# EAGLE design 105_vibrator (EAGLE 9.6.2)
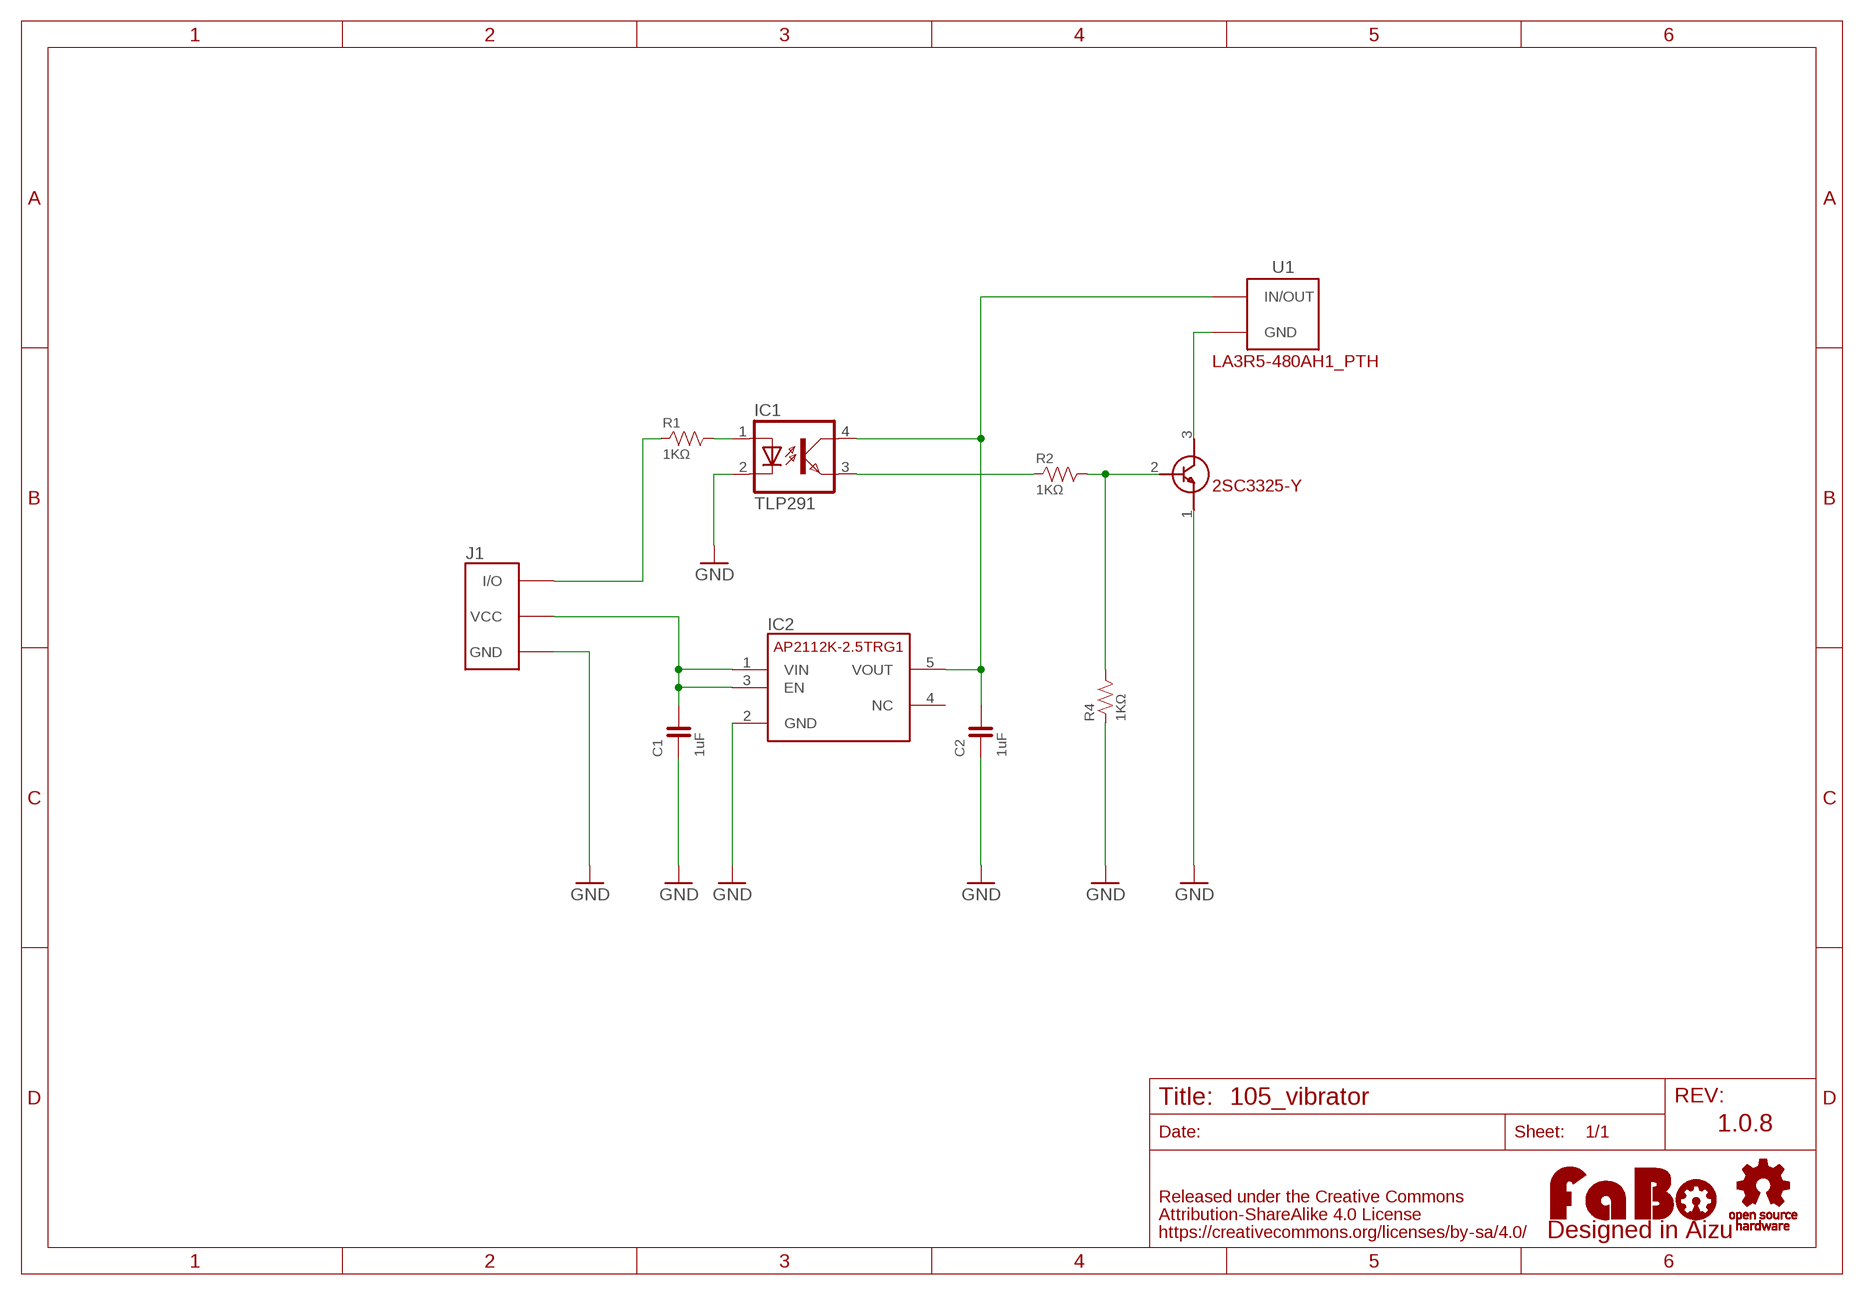
[diagram p0: schematic, sheet 1]

## Parts
C1  1uF  CAPACITOR-0603  [0603]
C2  1uF  CAPACITOR-0603  [0603]
IC1  TLP291  [MINI-FLAT-4]
IC2  AP2112-2.5  [SOT-23-5]
J1  FABO_BRICK_3PIN  [FABO_BRICK_3PIN]
LOGO1  LOGO_FABO-M  [LOGO_FABO_M]
R1  1KΩ  RESISTOR-0603  [0603]
R2  1KΩ  RESISTOR-0603  [0603]
R4  1KΩ  RESISTOR-0603  [0603]
TR1  2SC3325-Y  [SC-59]
U1  VIBRATOR  [LA3R5-480AH1_PTH]
U$2  LOGO_OSHW-M_BOTTOM  [LOGO_OSHW_M_BOTTOM]

## Nets
GND: C1.1 C2.1 IC1.2(C) IC2.2(GND) J1.GND R4.1 TR1.1(E)
N$1: J1.I/O R1.1
N$2: IC1.1(A) R1.2
N$4: IC1.3(EMIT) R2.1
N$5: C2.2 IC1.4(COL) IC2.5(VOUT) U1.P$1(IN/OUT)
N$7: TR1.3(C) U1.P$2(GND)
N$8: R2.2 R4.2 TR1.2(B)
VCC: C1.2 IC2.1(VIN) IC2.3(EN) J1.VCC
Unconnected: IC2.4(NC)

## Notes on the sheet
- LA3R5-480AH1_PTH
- 1.0.8

## Library data of the parts
C1 C2 = FaBo-Capacitor:CAPACITOR: CAPACITOR
IC1 = FaBo-Transistor:TLP291
IC2 = FaBo-Supply:AP2112-2.5
J1 = FaBo-Template:FABO_BRICK_3PIN: FaBo Brick 3pin
LOGO1 = component:LOGO_FABO
R1 R2 R4 = FaBo-Resistors:RESISTOR: RESISTOR
TR1 = FaBo-Transistor:2SC3325-Y
U1 = FaBo-Parts:VIBRATOR
U$2 = FaBo-etc:LOGO_OSHW

## Board
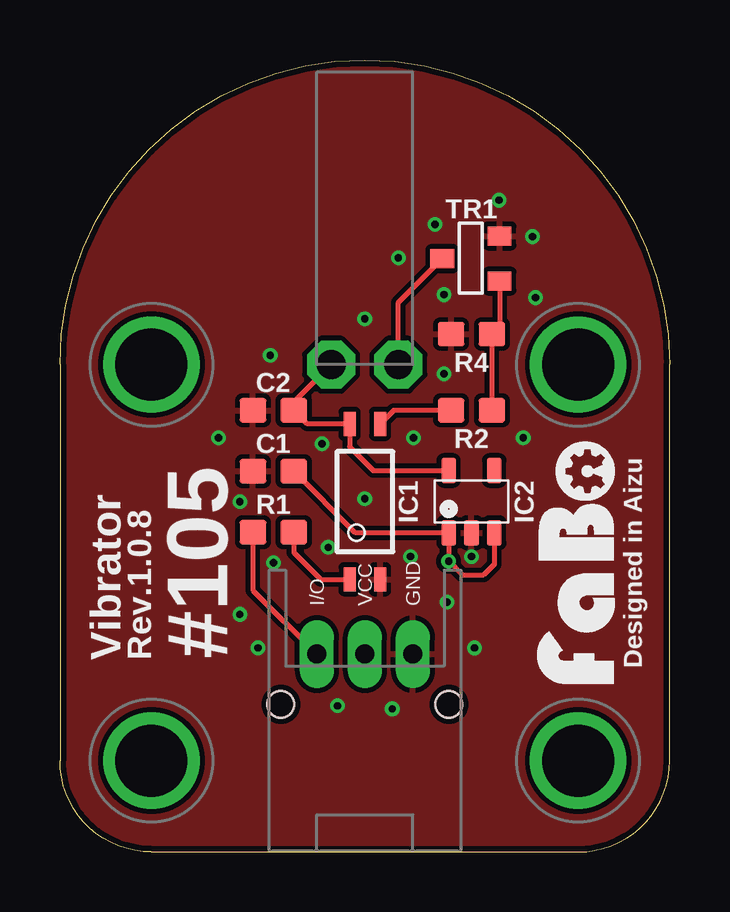
[diagram p1: board, top side]
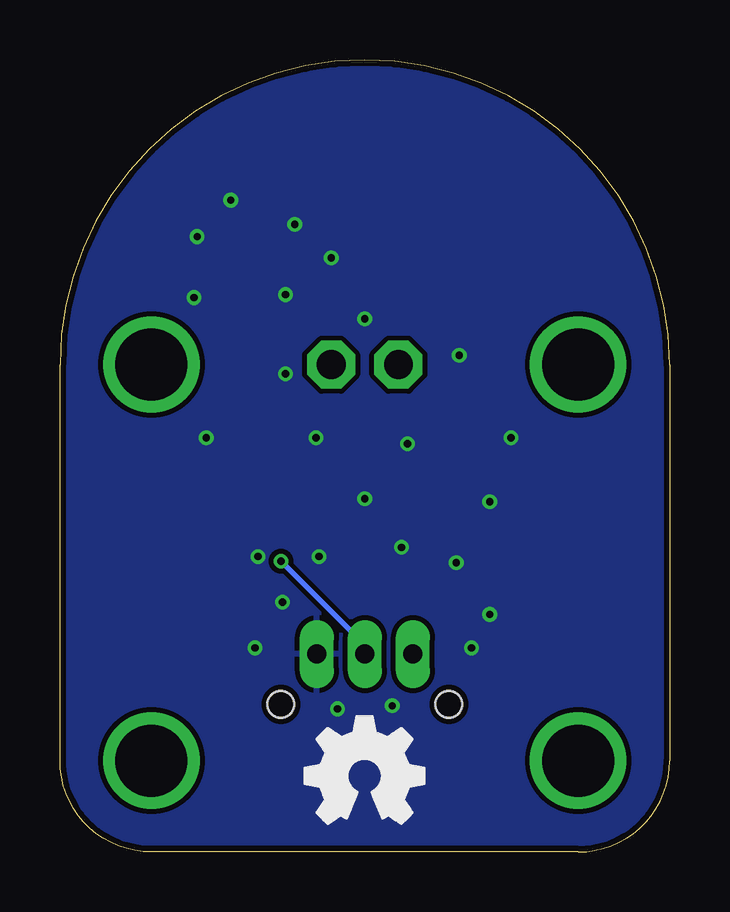
[diagram p2: board, bottom side, seen from below]

Size 25.4 x 33.02 mm. Coordinates in mm from the lower left corner, seen from the top.
Copper layers (1*16): Top 0.035mm / dielectric 1.6mm / Bottom 0.035mm
Design rules "PCBway": minimum track width 6mil, minimum drill 12mil, track to track 6mil, track to pad 6mil, pad to pad 6mil, via to via 6mil, smd to smd 6mil, copper to edge 10mil, drill to drill 10mil, minimum pad ring 10mil, minimum via ring 6mil, stop-mask expansion 2mil, vias tented up to drill 100mil, thermal gap 8mil

### Footprints (pad centres in the part's own frame; a part is rotated, then mirrored left to right if it is on the bottom)
0603 = smd 1.1 x 1: 1 -0.85,0; 2 0.85,0
MINI-FLAT-4 = smd 1 x 0.5: 1 -3.24,0.635; 2 -3.24,-0.635; 3 3.24,-0.635; 4 3.24,0.635
SOT-23-5 = smd 0.6 x 1.05: 1 -0.95,-1.3; 2 0,-1.3; 3 0.95,-1.3; 4 0.95,1.3; 5 -0.95,1.3
FABO_BRICK_3PIN = drill 0.8 pad 1.422 long: GND 2,-8.255; I/O -2,-8.255; VCC 0,-8.255 | drill 3 pad 3.81: P$1 -8.89,3.81; P$2 8.89,3.81; P$3 -8.89,-12.7; P$4 8.89,-12.7 | hole 1.1: -3.5,-10.355; 3.5,-10.355
SC-59 = smd 0.787 x 0.991: 1 -0.914,1.168; 2 0.965,1.168; 3 0.025,-1.219
LA3R5-480AH1_PTH = drill 1.2 pad 2 octagon: P$1 -1.4,0; P$2 1.4,0

### Placement (x,y rotation side)
C1  8.89,15.88 0 top
C2  8.89,18.41 0 top
IC1  12.7,14.61 90 top
IC2  17.14,14.61 0 top
J1  12.7,16.51 0 top
LOGO1  23.5,12.06 90 top
R1  8.89,13.34 0 top
R2  17.14,18.41 0 top
R4  17.14,21.59 0 top
TR1  17.14,24.77 270 top
U1  12.7,20.32 0 top
U$2  12.7,3.17 0 top

### Tracks (layer width: path | path; a pad name or v marks a point on that pad's centre or on a via)
GND  (via drill 0.3)
  other vias: 17.14,12.32 14.61,12.32 11.18,12.7 8.89,12.06 10.92,17.02 14.73,17.27 12.7,14.73 16.13,10.41 16,19.94 16,23.24 8.76,20.7 19.81,23.11 19.3,17.27 6.6,17.27 7.49,14.61 7.49,9.91 13.84,5.97 11.56,6.1 17.27,8.51 8.26,8.51 12.7,22.23 14.1,24.77 15.62,26.16 19.68,25.65 18.29,27.18
  pour Bottom (isolate 0.203): 0,0 25.4,0 25.4,33.02 0,33.02
  pour Top (isolate 0.203): 0,0 25.4,0 25.4,33.02 0,33.02
N$1
  Top 0.203: R1.1 8.04,10.91 J1.I/O
N$2
  Top 0.203: IC1.1 10.86,11.37 9.74,12.48 R1.2
N$4
  Top 0.203: R2.1 13.9,18.41 IC1.3
N$5
  Top 0.203: IC2.5 13.05,15.9 12.06,16.89 IC1.4 10.31,17.84 C2.2 9.74,18.76 U1.P$1
N$7
  Top 0.203: U1.P$2 14.1,22.91 TR1.3
N$8
  Top 0.203: R2.2 R4.2 18.31,21.91 TR1.2
VCC  (via drill 0.3)
  Top 0.203: IC2.3 18.09,12 17.65,11.56 16.76,11.56 v16.2,12.13 IC2.1 12.31,13.3 C1.2
  Bottom 0.203: J1.VCC 12.7,8.63 v16.2,12.13

### Text on the board
tPlace: #105 | Designed in Aizu | Vibrator | Rev.1.0.8